# Altium schematic sheet GSR.SchDoc: GSR Sensor
size A; DrawnBy: Jun Zhang; Revision: A; SheetNumber: 3; SheetTotal: 4
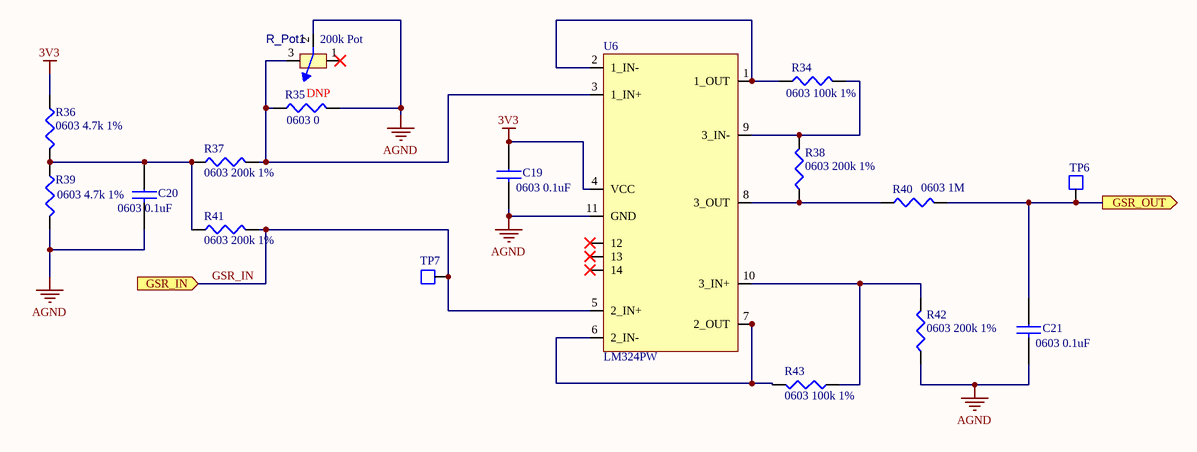
[diagram p0: GSR.SchDoc]

## Parts
C19  0603 0.1uF  [CAP_0603_CER]
C20  0603 0.1uF  [CAP_0603_CER]
C21  0603 0.1uF  [CAP_0603_CER]
R34  0603 100k 1%  [0603]
R35  0603 0  [0603]  (no BOM)
R36  0603 4.7k 1%  [0603]
R37  0603 200k 1%  [0603]
R38  0603 200k 1%  [0603]
R39  0603 4.7k 1%  [0603]
R40  0603 1M  [0603]
R41  0603 200k 1%  [0603]
R42  0603 200k 1%  [0603]
R43  0603 100k 1%  [0603]
R_Pot1  200k Pot  [R_200k_Pot]
TP6  0402_TEST_PT  [0402_PAD]  (value not drawn)
TP7  0402_TEST_PT  [0402_PAD]  (value not drawn)
U6  LM324PW  [TSOP65P640X120-14N]

## Ports
GSR_IN (in), GSR_OUT (out)

## Nets
3V3: C19.1 R36.1 U6.4(VCC)
AGND: C19.2 C20.2 C21.2 R35.2 R39.2 R42.1 R_Pot1.2 U6.11(GND)
GSR_IN: R41.2 TP7.1 U6.5(2_IN+) ; port GSR_IN
GSR_OUT: C21.1 R40.2 TP6.1 ; port GSR_OUT
NetC20_1: C20.1 R36.2 R37.1 R39.1 R41.1
NetR34_1: R34.1 U6.1(1_OUT) U6.2(1_IN-)
NetR34_2: R34.2 R38.2 U6.9(3_IN-)
NetR35_1: R35.1 R37.2 R_Pot1.3 U6.3(1_IN+)
NetR38_1: R38.1 R40.1 U6.8(3_OUT)
NetR42_2: R42.2 R43.1 U6.10(3_IN+)
NetR43_2: R43.2 U6.6(2_IN-) U6.7(2_OUT)

Not connected (* = marked no-connect by the designer): R_Pot1 1*; U6 12* 13* 14*

## Notes on the sheet
- (near R35) DNP

## Library data of the parts
C19 C20 = CAP_NP: Generic Cap for NC (No Polar) / ESR <30mOhm / ESL <1.5nH, / X7R; Manufacturer: KEMET; Manufacturer Part Number: C0603C104K5RAC7867; ComponentLink1Description: New link; ComponentLink1URL: *; Capacitance: 0.1uF; Package: 0603; Dielectric: X7R
C21 = CAP_NP: Generic Cap for NC (No Polar) / ESR <30mOhm / ESL <1.5nH, / X7R or X5R; Manufacturer: KEMET; Manufacturer Part Number: C0603C104K5RAC7867; ComponentLink1Description: New link; ComponentLink1URL: *; Capacitance: 0.1uF; Package: 0603; Dielectric: X7R
R34 R43 = RESISTOR: Generic Resistor; Manufacturer Part Number: CRCW0402100KFKEDC; Manufacturer: Vishay Dale; Resistance: 100k; Package: 0603
R35 = RESISTOR: Generic Resistor; Manufacturer Part Number: RC0402FR-070RL; Manufacturer: YAGEO; Resistance: 0; Package: 0603
R36 R39 = RESISTOR: Generic Resistor; Manufacturer Part Number: RC0402FR-074K7L; Manufacturer: YAGEO; Resistance: 4.7k; Package: 0603
R37 R38 R41 R42 = RESISTOR: Generic Resistor; Manufacturer Part Number: RC0402FR-13200KL; Manufacturer: YAGEO; Resistance: 200k; Package: 0603
R40 = RESISTOR: Generic Resistor; Manufacturer Part Number: RC0402FR-071ML; Manufacturer: YAGEO; Resistance: 1M; Package: 0603
R_Pot1 = R200k_Pot: SMD Single-Turn Trimmer Potentiometers 1/4 SQ 200KOHMS 10% 0.5WATTS; Manufacturer: Bourns; Manufacturer Part Number: 3361P-1-204GLF; Resistance: 200kR; Power Rating: 500mW; Number of Turns: 1; Temperature Coefficient: 100ppm/°C; Supplier 1: Digi-Key; Supplier Part Number 1: 3361P-1-204GLFCT-ND; RoHS: Yes; Category: Variable Resistors and Potentiometers; Stock 1: 1039; Pricing 1: 1=1.26000, 10=1.11000, 25=0.99920, 50=0.96200, 100=0.92500, 250=0.86952 (USD); Mount: Surface Mount; Contact Plating: Tin,Matte; Min Operating Temperature: -55°C; Max Operating Temperature: 125°C; Tolerance: 10%; Packaging: Tape and Reel; Package Quantity: 750; Resistor Type: Cermet; Termination: Gull Wing; Max Power Dissipation: 500mW; Series: Trimpot® 3361 - Sealed; Technology: CERMET; Length: 6.71mm; Width: 0.264inch; Height: 0.192inch; Depth: 8.53mm; Radiation Hardening: No; Military Standard: Not; RoHS Compliant: Yes; ComponentLink1URL: https://datasheet.ciiva.com/2157/3361-2157333.pdf?src-supplier=Digi-Key; ComponentLink1Description: https://datasheet.ciiva.com/2157/3361-2157333.pdf?src-supplier=Digi-Key; ComponentLink2URL: https://datasheet.ciiva.com/2157/3361-2157335.pdf?src-supplier=Digi-Key; ComponentLink2Description: https://datasheet.ciiva.com/2157/3361-2157335.pdf?src-supplier=Digi-Key; ComponentLink3URL: https://datasheet.ciiva.com/2157/3361-2157334.pdf?src-supplier=Digi-Key; ComponentLink3Description: https://datasheet.ciiva.com/2157/3361-2157334.pdf?src-supplier=Digi-Key; ComponentLink4URL: https://datasheet.ciiva.com/15156/getdatasheetpartid-347912-15156998.pdf?src-supplier=Verical; ComponentLink4Description: https://datasheet.ciiva.com/15156/getdatasheetpartid-347912-15156998.pdf?src-supplier=Verical
U6 = LM324PW: Integrated Circuit Operational Amplifier LM324/TSSOP/LM324PW TEXAS INSTRUMENT RoHS TSSOP14; Manufacturer: Texas Instruments; Min Supply Voltage: 3V; Max Supply Voltage: 32V; Min Dual Supply Voltage: 1.5V; Max Dual Supply Voltage: 16V; Voltage Gain: 100dB; Slew Rate: 0.5V/µs; Common Mode Rejection Ratio: 65dB; Number of Circuits: 4; Gain Bandwidth Product: 1.2MHz; Input Bias Current: 250nA; Operating Supply Current: 1.4mA; Output Current per Channel: 60mA; Amplifier Type: GENERAL PURPOSE; Nominal Supply Current: 3mA; Output Current: 30mA; Input Offset Voltage (Vos): 7mV; Dual Supply Voltage: 9V; Supplier 1: Digi-Key; Supplier Part Number 1: 296-26098-5-ND; Manufacturer Part Number: LM324PW; RoHS: Yes; Category: Amplifiers - Op Amps, Buffer, Instrumentation; Stock 1: 4297; Pricing 1: 1=0.95000, 10=0.84700, 25=0.80440, 100=0.66070, 250=0.61760, 500=0.54580, 1000=0.47425 (USD); Mount: Surface Mount; Case/Package: TSSOP; Number of Pins: 14; Min Operating Temperature: 0°C; Max Operating Temperature: 70°C; Package Quantity: 90; Packaging: Rail/Tube; Operating Supply Voltage: 16V; Unity Gain Bandwidth Product: 1.2MHz; Number of Channels: 4; Number of Elements: 4; Supply Current: 3mA; Technology: BIPOLAR; Bandwidth: 1.2MHz; Series: -; Number of Amplifiers: 4; Length: 5mm; Width: 4.4mm; Height: 1.15mm; Radiation Hardening: No; RoHS Compliant: Yes; Lead Free: Lead Free; REACH SVHC: No SVHC; ComponentLink1URL: https://datasheet.ciiva.com/1796/lm324-1796594.pdf?src-supplier=Digi-Key; ComponentLink1Description: https://datasheet.ciiva.com/1796/lm324-1796594.pdf?src-supplier=Digi-Key; ComponentLink2URL: https://datasheet.ciiva.com/7709/1633632-7709818.pdf?src-supplier=Element14; ComponentLink2Description: https://datasheet.ciiva.com/7709/1633632-7709818.pdf?src-supplier=Element14